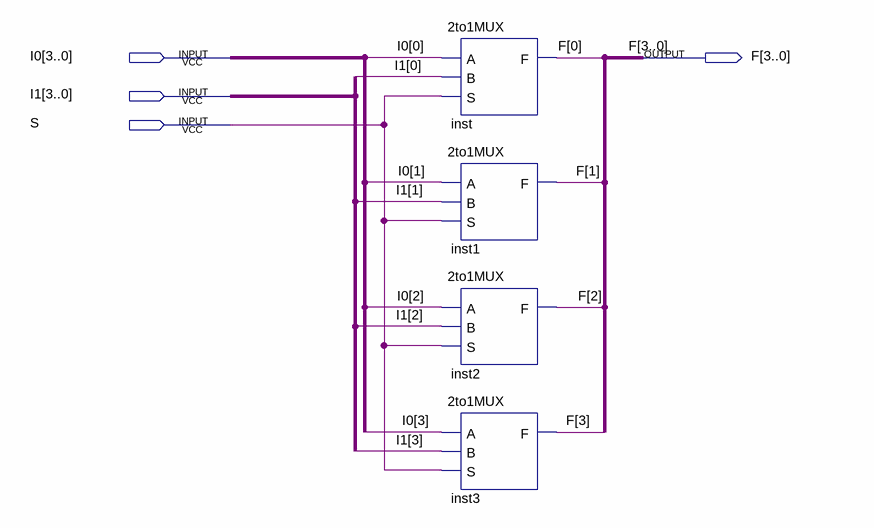
[diagram p0: schematic sheet]
// Quartus schematic 4b_2to1MUX.bdf as structural Verilog: 4 symbols, 4 pins
module \4b_2to1MUX  (
  input  [3:0] I0,
  input  [3:0] I1,
  input  S,
  output [3:0] F
);

  \2to1MUX  inst (.A(I0[0]), .B(I1[0]), .S(S), .F(F[0]));
  \2to1MUX  inst1 (.A(I0[1]), .B(I1[1]), .S(S), .F(F[1]));
  \2to1MUX  inst2 (.A(I0[2]), .B(I1[2]), .S(S), .F(F[2]));
  \2to1MUX  inst3 (.A(I0[3]), .B(I1[3]), .S(S), .F(F[3]));
endmodule
